# Altium schematic sheet Connector.SchDoc: Homemade Microcrontroller
size A4; DrawnBy: Grady Kwetala; Revision: V1.0
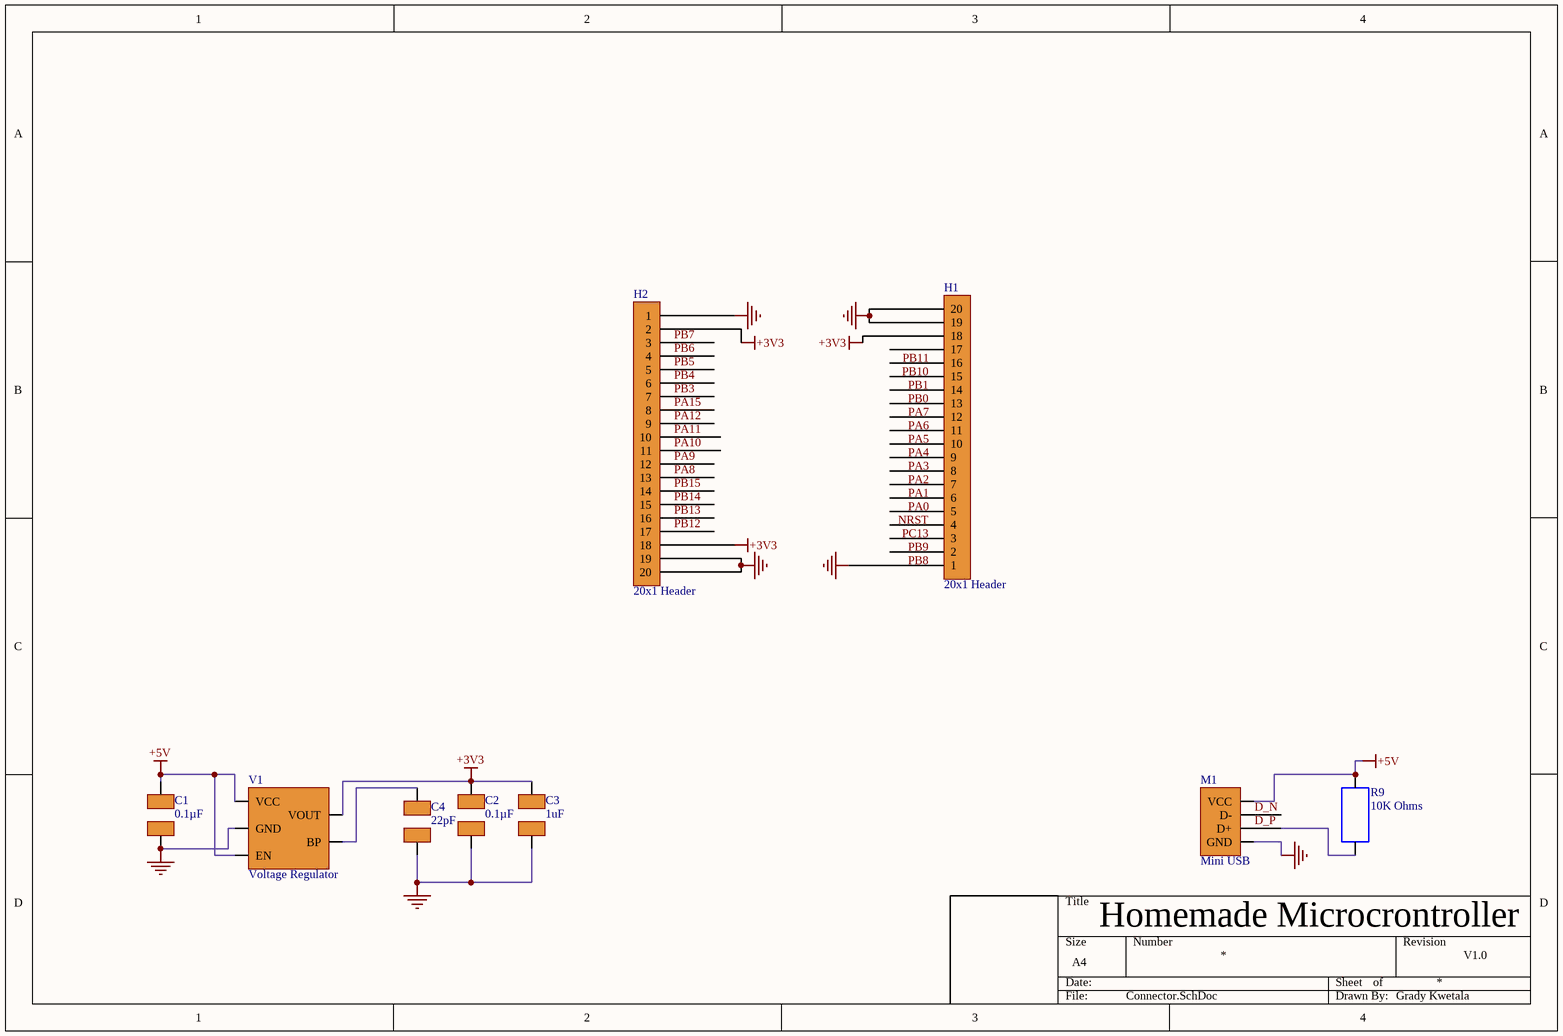
[diagram p0: Connector.SchDoc]

## Parts
C1  0.1µF  [capacitor]
C2  0.1µF  [capacitor]
C3  1uF  [capacitor]
C4  22pF  [capacitor]
H1  20x1 Header  [20 Pin Header]
H2  20x1 Header  [20 Pin Header]
M1  Mini USB  [mini USB]
R9  10K Ohms  [Resistor]
V1  Voltage Regulator  [Voltage regulator]

## Nets
+3V3: C2.2 C3.2 H1.18 H2.2 H2.18 V1.5(VOUT)
+5V: C1.2 M1.1(VCC) R9.2 V1.1(VCC) V1.3(EN)
GND: C1.1 C2.1 C3.1 C4.1 H1.1 H1.19 H1.20 H2.1 H2.19 H2.20 M1.4(GND) V1.2(GND)
D_N: M1.2(D-)
D_P: M1.3(D+) R9.1
NRST: H1.5
PA0: H1.6
PA1: H1.7
PA2: H1.8
PA3: H1.9
PA4: H1.10
PA5: H1.11
PA6: H1.12
PA7: H1.13
PA8: H2.13
PA9: H2.12
PA10: H2.11
PA11: H2.10
PA12: H2.9
PA15: H2.8
PB0: H1.14
PB1: H1.15
PB3: H2.7
PB4: H2.6
PB5: H2.5
PB6: H2.4
PB7: H2.3
PB8: H1.2
PB9: H1.3
PB10: H1.16
PB11: H1.17
PB12: H2.17
PB13: H2.16
PB14: H2.15
PB15: H2.14
PC13: H1.4
NetC4_2: C4.2 V1.4(BP)

## Library data of the parts
C1 C2 = C0805C104J5RACTU: KEMET - C0805C104J5RACTU - SMD Multilayer Ceramic Capacitor, 0.1 µF, 50 V, 0805 [2012 Metric], ± 5%, X7R, C Series KEMET; Capacitance: 100nF; Voltage Rating (DC): 50V; Supplier 1: Digi-Key; Supplier Part Number 1: 399-1171-1-ND; Manufacturer: KEMET; Manufacturer Part Number: C0805C104J5RACTU; Stock 1: 675679; Pricing 1: 1=0.19000, 10=0.13100, 100=0.06630, 500=0.04538, 1000=0.04015 (USD); RoHS: Yes; Mount: Surface Mount,PCB; Case/Package: 0805; Number of Pins: 2; Dielectric Material: Ceramic; Case Code (Metric): 2012; Case Code (Imperial): 0805; Contact Plating: Tin,Matte; Min Operating Temperature: -55°C; Max Operating Temperature: 125°C; Packaging: Tape and Reel; Tolerance: 5%; Dielectric: X7R; Voltage Rating: 50V; Package Quantity: 1; Termination: SMD/SMT; Voltage: 50V; Length: 2mm; Height: 0.9mm; Width: 0.049inch; Thickness: 0.035inch; Lead Pitch: 0.75mm; Depth: 1.25mm; Radiation Hardening: No; REACH SVHC: No SVHC; ComponentLink1URL: https://datasheet.ciiva.com/7842/1732721-7842179.pdf?src-supplier=Element14; ComponentLink1Description: https://datasheet.ciiva.com/7842/1732721-7842179.pdf?src-supplier=Element14; ComponentLink2URL: https://datasheet.ciiva.com/14589/70095383-14589015.pdf?src-supplier=Allied+Electronics; ComponentLink2Description: https://datasheet.ciiva.com/14589/70095383-14589015.pdf?src-supplier=Allied+Electronics; ComponentLink3URL: https://datasheet.ciiva.com/5417/kem-c1002-x7r-smd-5417352.pdf?src-supplier=Mouser; ComponentLink3Description: https://datasheet.ciiva.com/5417/kem-c1002-x7r-smd-5417352.pdf?src-supplier=Mouser; ComponentLink4URL: https://datasheet.ciiva.com/39122/docfinderpartnumberc0402c102k5ractu-39122924.pdf?src-supplier=Onlinecomponents.com; ComponentLink4Description: https://datasheet.ciiva.com/39122/docfinderpartnumberc0402c102k5ractu-39122924.pdf?src-supplier=Onlinecomponents.com; ComponentLink5URL: https://datasheet.ciiva.com/7258/1828800-7258413.pdf?src-supplier=Newark; ComponentLink5Description: https://datasheet.ciiva.com/7258/1828800-7258413.pdf?src-supplier=Newark; ComponentLink6URL: https://datasheet.ciiva.com/28682/1851736-28682223.pdf?src-supplier=Element14; ComponentLink6Description: https://datasheet.ciiva.com/28682/1851736-28682223.pdf?src-supplier=Element14
C3 = GCM21BR71H105KA03K: Cap Ceramic 1uF 50V X7R 10% Pad SMD 0805 125C Automotive T/R; Manufacturer: Murata; Supplier 1: Digi-Key; Supplier Part Number 1: 490-13310-1-ND; Manufacturer Part Number: GCM21BR71H105KA03K; Stock 1: 44921; Pricing 1: 1=0.31000, 10=0.21600, 100=0.12970, 500=0.09726, 1000=0.08213, 2500=0.07781, 5000=0.07349 (USD); RoHS: Yes; Mount: Surface Mount; Case/Package: 0805; Weight: 0.000335oz; Case Code (Imperial): 0805; Case Code (Metric): 2012; Min Operating Temperature: -55°C; Max Operating Temperature: 125°C; Tolerance: 10%; Capacitance: 1uF; Packaging: Tape and Reel; Voltage Rating: 50V; Dielectric: X7R; Termination: SMD/SMT; Voltage Rating (DC): 50V; Package Quantity: 10000; Length: 0.079inch; Height: 1.25mm; Width: 1.25mm; Thickness: 0.055inch; Ratings: AEC-Q200; ComponentLink1URL: http://www.mouser.com/ds/2/281/c03e-806517.pdf?src-supplier=Mouser; ComponentLink1Description: http://www.mouser.com/ds/2/281/c03e-806517.pdf?src-supplier=Mouser; ComponentLink2URL: https://www.murata.com/~/media/webrenewal/support/library/catalog/products/capacitor/mlcc/c03e.ashx?la=en-us&src-supplier=Digi-Key; ComponentLink2Description: https://www.murata.com/~/media/webrenewal/support/library/catalog/products/capacitor/mlcc/c03e.ashx?la=en-us&src-supplier=Digi-Key
C4 = C0805C220J5GACTU: Capacitor: ceramic; MLCC; 22pF; 50VDC; C0G; ±5%; SMD; 0805; Manufacturer: KEMET; Temperature Coefficient: 30ppm/°C; Voltage Rating: 50V; Supplier 1: Digi-Key; Supplier Part Number 1: 399-1113-1-ND; Manufacturer Part Number: C0805C220J5GACTU; Stock 1: 658795; Pricing 1: 1=0.10000, 10=0.07000, 100=0.03100, 500=0.02214, 1000=0.01739 (USD); RoHS: Yes; Mount: PCB,Surface Mount; Case/Package: 0805; Weight: 0.000194oz; Case Code (Metric): 2012; Case Code (Imperial): 0805; Contact Plating: Tin,Matte; Dielectric Material: Ceramic; Contact Material: Tin; Min Operating Temperature: -55°C; Max Operating Temperature: 125°C; Dielectric: C0G; Packaging: Tape and Reel; Capacitance: 22pF; Tolerance: 5%; Package Quantity: 1; Voltage Rating (DC): 50V; Termination: SMD/SMT; Voltage: 50V; Length: 2mm; Height: 0.78mm; Width: 1.25mm; Thickness: 0.035inch; Depth: 1.25mm; Radiation Hardening: No; Lead Free: Lead Free; REACH SVHC: No SVHC; ComponentLink1URL: https://datasheet.ciiva.com/7842/kem-c1003-c0g-smd-7842569.pdf?src-supplier=Element14; ComponentLink1Description: https://datasheet.ciiva.com/7842/kem-c1003-c0g-smd-7842569.pdf?src-supplier=Element14; ComponentLink2URL: https://datasheet.ciiva.com/28668/1789732-28668761.pdf?src-supplier=Element14; ComponentLink2Description: https://datasheet.ciiva.com/28668/1789732-28668761.pdf?src-supplier=Element14; ComponentLink3URL: https://datasheet.ciiva.com/7842/1372242-7842570.pdf?src-supplier=Element14; ComponentLink3Description: https://datasheet.ciiva.com/7842/1372242-7842570.pdf?src-supplier=Element14
H1 H2 = 61304011121: CONN HEADER VERT 40POS 2.54MM; Manufacturer: Wurth Electronics; Connector Type: Male Pin; Number of Positions: 40; Gender: Male; Pitch: 0.1inch; Supplier 1: Digi-Key; Supplier Part Number 1: 732-5307-ND; Manufacturer Part Number: 61304011121; RoHS: Yes; Mount: Through Hole; Contact Plating: Gold; Color: Black; Contact Material: Copper; Packaging: Bulk; Termination: Solder; Number of Contacts: 40; Number of Rows: 1; Contact Mating Length: 0.236inch; REACH SVHC: Unknown; ComponentLink1URL: http://www.farnell.com/cad/1737268.pdf?src-supplier=Element14; ComponentLink1Description: http://www.farnell.com/cad/1737268.pdf?src-supplier=Element14; ComponentLink2URL: https://katalog.we-online.de/em/datasheet/6130xx11121.pdf?src-supplier=Digi-Key; ComponentLink2Description: https://katalog.we-online.de/em/datasheet/6130xx11121.pdf?src-supplier=Digi-Key
M1 = 0548191572: Conn Mini USB Type B RCP 5 POS 0.8mm Solder RA SMD 5 Terminal 1 Port Embossed T/R; Manufacturer: Molex; Number of Contacts: 5; Gender: Receptacle; Number of Ports: 1; Supplier 1: Digi-Key; Supplier Part Number 1: WM6794CT-ND; Manufacturer Part Number: 0548191572; Stock 1: 2164; Pricing 1: 1=2.51000, 10=2.27800, 25=2.13840, 50=2.04540, 100=1.95240, 250=1.76648, 500=1.62702, 1000=1.39458 (USD); RoHS: Yes; Mount: Surface Mount,Horizontal; Housing Material: Polyphthalamide; Contact Material: Copper Alloy; Contact Plating: Gold; Number of Terminals: 5; Min Operating Temperature: -20°C; Max Operating Temperature: 85°C; Orientation: Right Angle; Packaging: Tape and Reel; Package Quantity: 4800; Termination: Solder; Connector Type: USB; Length: 9.9mm; Pitch: 0.8mm; Depth: 9mm; ComponentLink1URL: https://datasheet.ciiva.com/3897/190710548191572-io-nectors-3897712.pdf?src-supplier=Arrow; ComponentLink1Description: https://datasheet.ciiva.com/3897/190710548191572-io-nectors-3897712.pdf?src-supplier=Arrow
R9 = PHT0603Y1002BGT: RES SMD 10KOHM 0.1% 0.0375W 0603; Manufacturer: Vishay Sfernice; Resistance: 10kR; Temperature Coefficient: 15ppm/°C; Voltage Rating: 75V; Power Rating: 12.5mW; Supplier 1: Digi-Key; Supplier Part Number 1: PHTB-10KCT-ND; Manufacturer Part Number: PHT0603Y1002BGT; Stock 1: 173; Pricing 1: 1=11.30000, 10=10.59500, 100=7.53460 (USD); RoHS: Yes; Case/Package: 0603; Number of Pins: 2; Case Code (Imperial): 0603; Case Code (Metric): 1608; Min Operating Temperature: -55°C; Max Operating Temperature: 215°C; Tolerance: 0.1%; Packaging: Tape and Reel; Composition: Thin Film; Termination: SMD/SMT; Voltage Rating (DC): 75V; Length: 1.6mm; Height: 0.5mm; Width: 0.8mm; Radiation Hardening: No; REACH SVHC: No SVHC; ComponentLink1URL: https://datasheet.ciiva.com/9052/pht-9052382.pdf?src-supplier=Avnet; ComponentLink1Description: https://datasheet.ciiva.com/9052/pht-9052382.pdf?src-supplier=Avnet
V1 = RT9193-33GB: IC REG LINEAR 3.3V 300MA SOT23-5; Manufacturer: Richtek; Number of Regulators: 1; Min Current Limit: 360mA; Dropout Voltage: 220mV; Min Input Voltage: 2.5V; Max Input Voltage: 5.5V; Supplier 1: Digi-Key; Supplier Part Number 1: 1028-1014-1-ND; Manufacturer Part Number: RT9193-33GB; Stock 1: 11176; Pricing 1: 1=0.50000, 10=0.43100, 25=0.40240, 100=0.29900, 250=0.25300, 500=0.24150, 1000=0.17825 (USD); RoHS: Yes; Mount: Surface Mount; Case/Package: SOT-23-5; Number of Pins: 5; Min Operating Temperature: -40°C; Max Operating Temperature: 125°C; Packaging: Tape and Reel; Output Voltage: 3.3V; Nominal Output Voltage: 3.3V; Output Current: 300mA; Lead Free: Lead Free; REACH SVHC: Unknown; ComponentLink1URL: https://datasheet.ciiva.com/28652/1782157-28652989.pdf?src-supplier=Element14; ComponentLink1Description: https://datasheet.ciiva.com/28652/1782157-28652989.pdf?src-supplier=Element14; ComponentLink2URL: https://datasheet.ciiva.com/2046/3d3futf-83fb3frfm5mtkzlte2lnbkzg3d3d3f3d-2046896.pdf?src-supplier=Digi-Key; ComponentLink2Description: https://datasheet.ciiva.com/2046/3d3futf-83fb3frfm5mtkzlte2lnbkzg3d3d3f3d-2046896.pdf?src-supplier=Digi-Key